# EasyEDA Pro project Isaac.epro

# Schematic Schematic1_1
Board Name: Board1_1; Create Date: 2025-03-01; Page Name: P1; Project Name: ESP-Glasses; Schematic Name: Schematic1_1; Update Date: 2025-03-04; Company: 嘉立创EDA; Page Size: A4; Version: V1.0
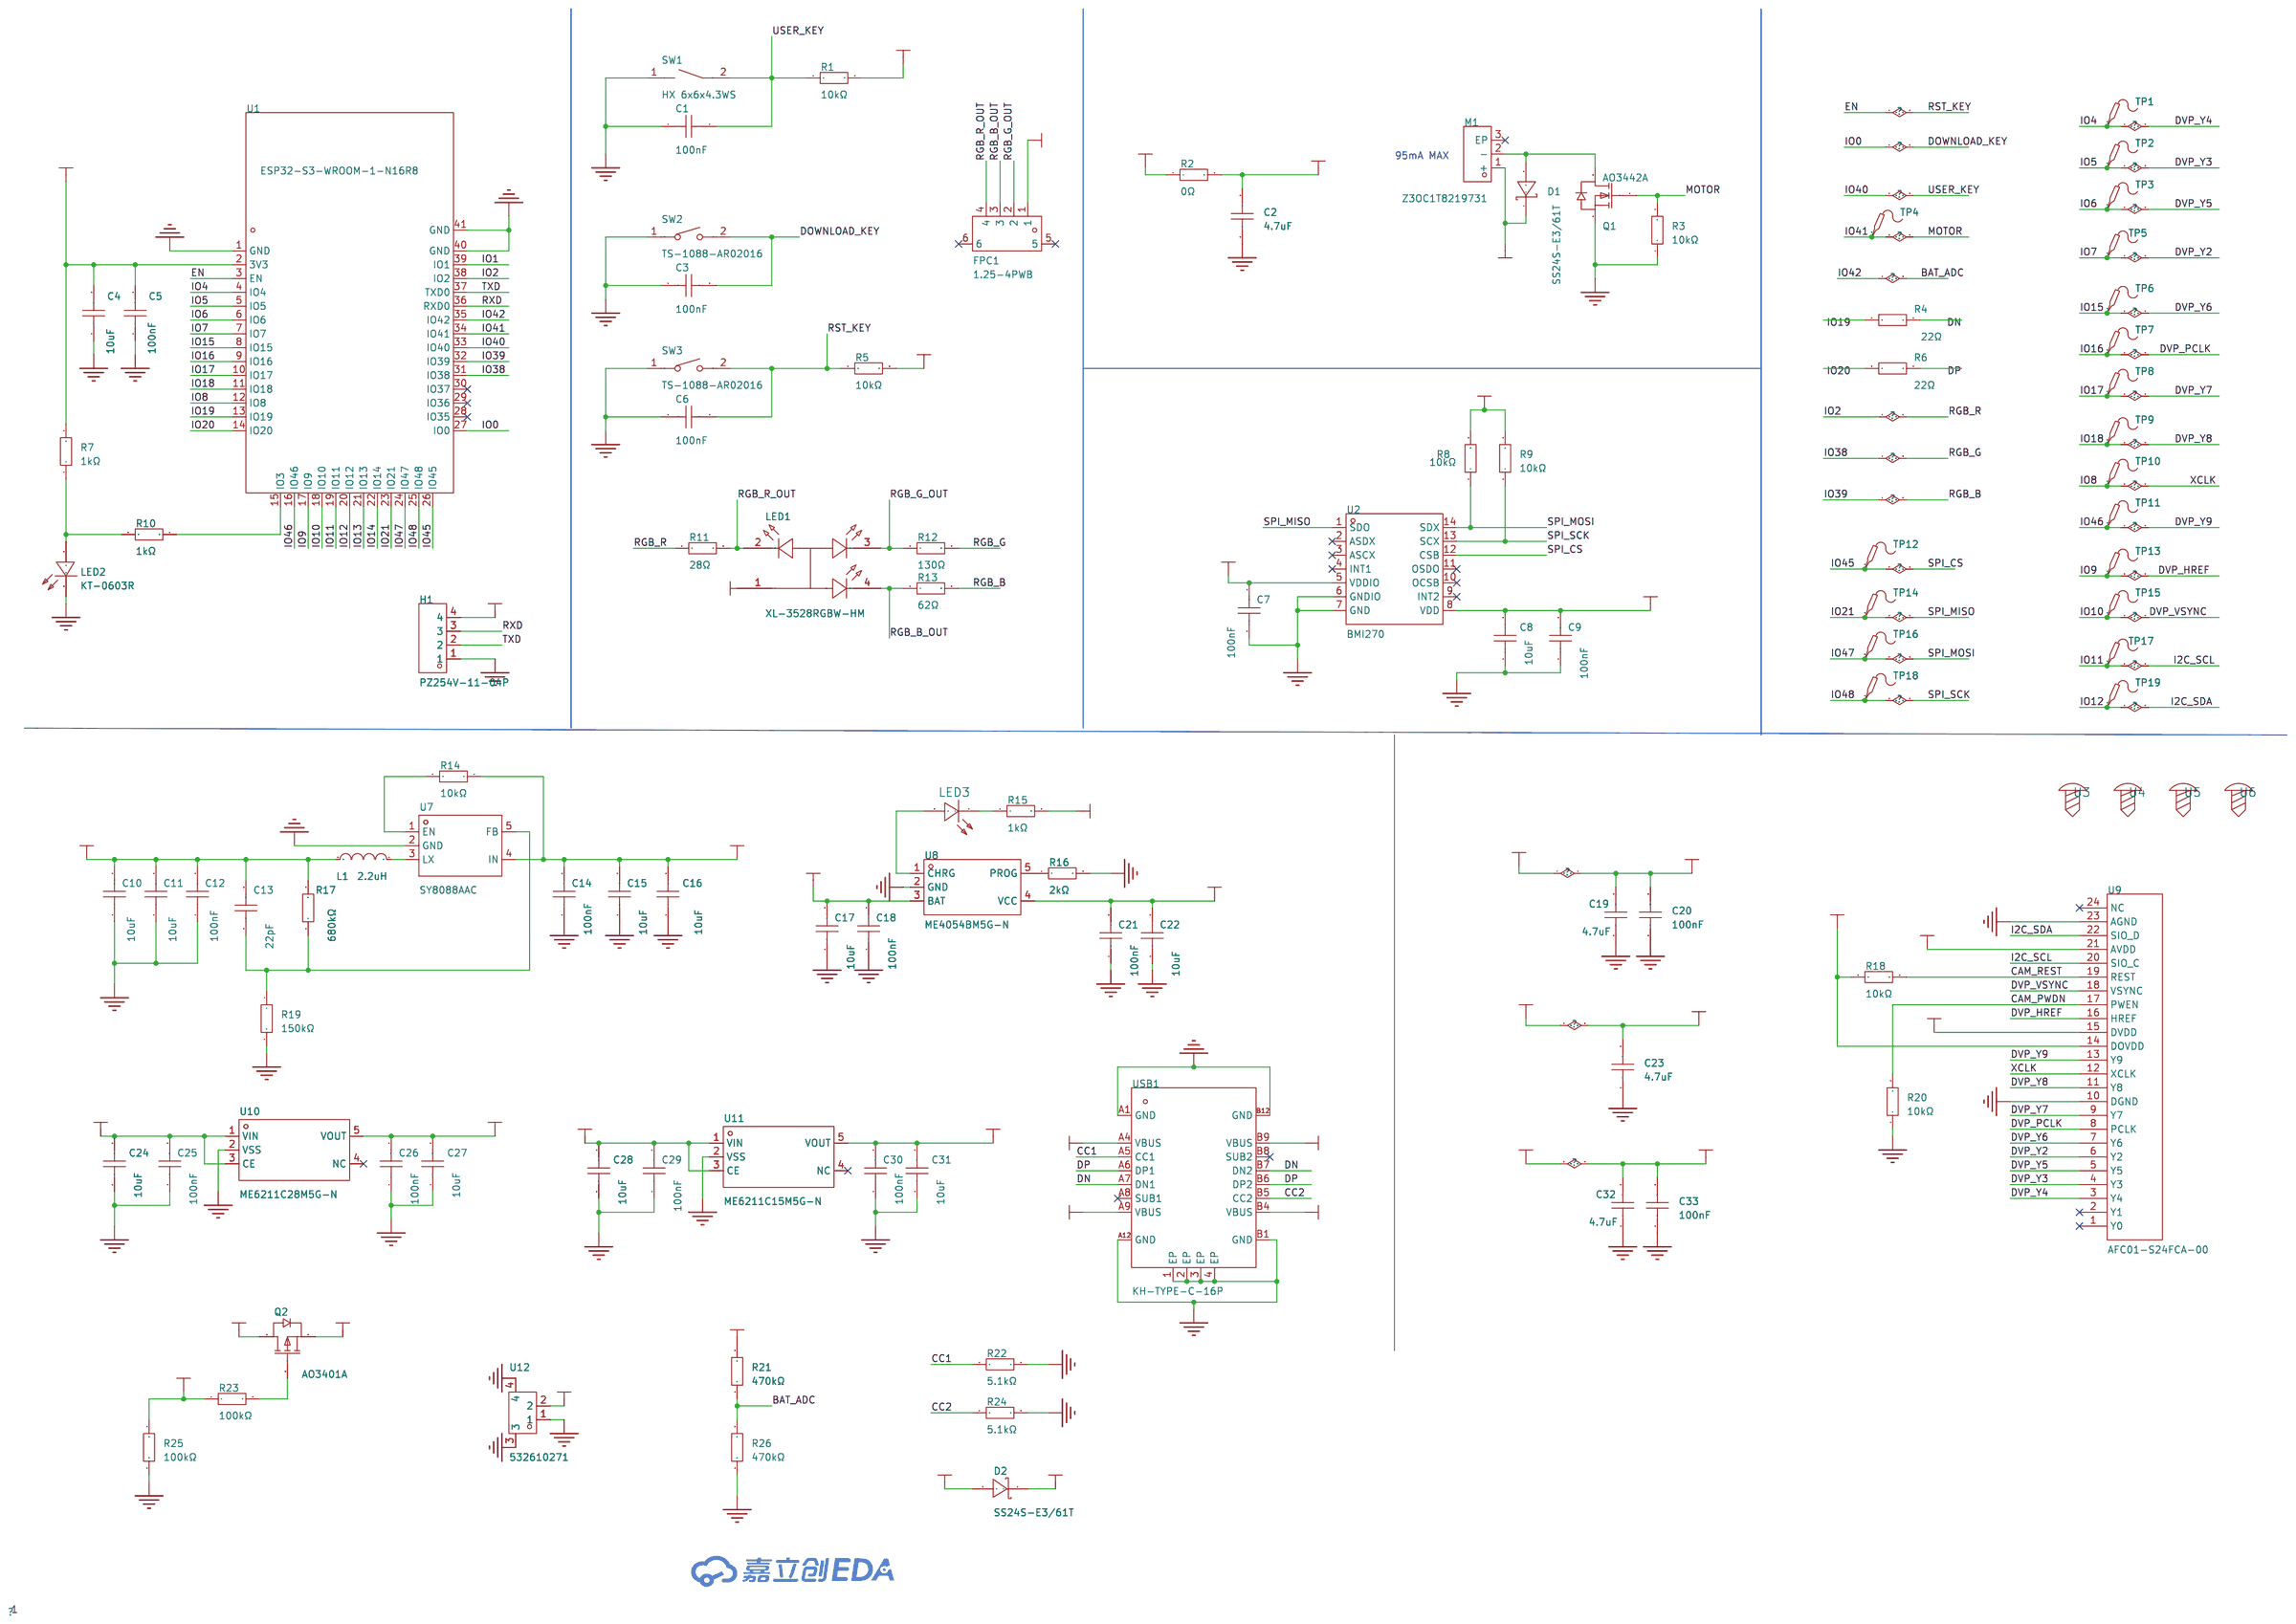
[diagram p0: schematic sheet]

## Parts
C1  100nF  [C0603]
C2  4.7uF  [C0603]
C3  100nF  [C0603]
C4  10uF  [C0603]
C5  100nF  [C0603]
C6  100nF  [C0603]
C7  100nF  [C0603]
C8  10uF  [C0603]
C9  100nF  [C0603]
C10  10uF  [C0603]
C11  10uF  [C0603]
C12  100nF  [C0603]
C13  22pF  [C0603]
C14  100nF  [C0603]
C15  10uF  [C0603]
C16  10uF  [C0603]
C17  10uF  [C0603]
C18  100nF  [C0603]
C19  4.7uF  [C0603]
C20  100nF  [C0603]
C21  100nF  [C0603]
C22  10uF  [C0603]
C23  4.7uF  [C0603]
C24  10uF  [C0603]
C25  100nF  [C0603]
C26  100nF  [C0603]
C27  10uF  [C0603]
C28  10uF  [C0603]
C29  100nF  [C0603]
C30  100nF  [C0603]
C31  10uF  [C0603]
C32  4.7uF  [C0603]
C33  100nF  [C0603]
D1  SS24S-E3/61T  [SMA_L4.4-W2.8-LS5.4-RD]
D2  SS24S-E3/61T  [SMA_L4.4-W2.8-LS5.4-RD]
FPC1  1.25-4PWB  [CONN-SMD_1.25-4PWB]
H1  PZ254V-11-04P  [HDR-TH_4P-P2.54-V-M]
L1  2.2uH  [L0603]
LED1  XL-3528RGBW-HM  [LED-SMD_4P-L3.2-W2.8-LS3.5-BL-CW]
LED2  KT-0603R  [LED0603-RD]
LED3  KT-0603R  [LED0603-RD]
M1  Z3OC1T8219731  [VIBRATING-MOTOR-SMD_3P-C9900001680]
Q1  AO3442A  [SOT-23-3_L2.9-W1.3-P1.90-LS2.4-BR]
Q2  AO3401A  [SOT-23_L2.9-W1.3-P1.90-LS2.4-BR]
R1  10kΩ  [R0603_2]
R2  0Ω  [R0603_2]
R3  10kΩ  [R0603_2]
R4  22Ω  [R0603_2]
R5  10kΩ  [R0603_2]
R6  22Ω  [R0603_2]
R7  1kΩ  [R0603_2]
R8  10kΩ  [R0603_1]
R9  10kΩ  [R0603_1]
R10  1kΩ  [R0603_2]
R11  28Ω  [R0603_2]
R12  130Ω  [R0603_2]
R13  62Ω  [R0603_2]
R14  10kΩ  [R0603_2]
R15  1kΩ  [R0603_2]
R16  2kΩ  [R0603_2]
R17  680kΩ  [R0603_2]
R18  10kΩ  [R0603_2]
R19  150kΩ  [R0603_2]
R20  10kΩ  [R0603_2]
R21  470kΩ  [R0603_2]
R22  5.1kΩ  [R0603_2]
R23  100kΩ  [R0603_2]
R24  5.1kΩ  [R0603_2]
R25  100kΩ  [R0603_2]
R26  470kΩ  [R0603_2]
SW1  HX 6x6x4.3WS  [SW-SMD_HX6X6X4.3WS]
SW2  TS-1088-AR02016  [SW-SMD_L3.9-W3.0-P4.45]
SW3  TS-1088-AR02016  [SW-SMD_L3.9-W3.0-P4.45]
TP1  -  [TESTPOINT-SMD_BD1.5_YZ212411105R-01]
TP2  -  [TESTPOINT-SMD_BD1.5_YZ212411105R-01]
TP3  -  [TESTPOINT-SMD_BD1.5_YZ212411105R-01]
TP4  -  [TESTPOINT-SMD_BD1.5_YZ212411105R-01]
TP5  -  [TESTPOINT-SMD_BD1.5_YZ212411105R-01]
TP6  -  [TESTPOINT-SMD_BD1.5_YZ212411105R-01]
TP7  -  [TESTPOINT-SMD_BD1.5_YZ212411105R-01]
TP8  -  [TESTPOINT-SMD_BD1.5_YZ212411105R-01]
TP9  -  [TESTPOINT-SMD_BD1.5_YZ212411105R-01]
TP10  -  [TESTPOINT-SMD_BD1.5_YZ212411105R-01]
TP11  -  [TESTPOINT-SMD_BD1.5_YZ212411105R-01]
TP12  -  [TESTPOINT-SMD_BD1.5_YZ212411105R-01]
TP13  -  [TESTPOINT-SMD_BD1.5_YZ212411105R-01]
TP14  -  [TESTPOINT-SMD_BD1.5_YZ212411105R-01]
TP15  -  [TESTPOINT-SMD_BD1.5_YZ212411105R-01]
TP16  -  [TESTPOINT-SMD_BD1.5_YZ212411105R-01]
TP17  -  [TESTPOINT-SMD_BD1.5_YZ212411105R-01]
TP18  -  [TESTPOINT-SMD_BD1.5_YZ212411105R-01]
TP19  -  [TESTPOINT-SMD_BD1.5_YZ212411105R-01]
U1  ESP32-S3-WROOM-1-N16R8  [WIRELM-SMD_ESP32-S3-WROOM-1]
U2  BMI270  [LGA-14_L3.0-W2.5-P0.50-BR]
U3  -  [M2.5]  (no BOM)
U4  -  [M2.5]  (no BOM)
U5  -  [M2.5]  (no BOM)
U6  -  [M2.5]  (no BOM)
U7  SY8088AAC  [SOT-23-5_L3.0-W1.7-P0.95-LS2.8-BR]
U8  ME4054BM5G-N  [TSOT-23-5_L2.9-W1.6-P0.95-LS2.8-BL]
U9  AFC01-S24FCA-00  [FPC0.5 2H-S-W-24P]
U10  ME6211C28M5G-N  [SOT-23-5_L3.0-W1.7-P0.95-LS2.8-BR]
U11  ME6211C15M5G-N  [SOT-23-5_L3.0-W1.7-P0.95-LS2.8-BR]
U12  532610271  [CONN-SMD_532610271]
USB1  KH-TYPE-C-16P  [USB-C-SMD_KH-TYPE-C-16P]

## Library data of the parts
C1 C3 C5-C7 C9 C12 C14 C18 C20 C21 C25 C26 C29 C30 C33 = CC0603KRX7R9BB104: 容值:100nF;精度:±10%;额定电压:50V;材质(温度系数):X7R;; LCSC Part Name: 100nF ±10% 50V; Supplier Part: C14663; Manufacturer: YAGEO(国巨); Supplier Footprint: 0603; JLCPCB Part Class: Basic Part; Datasheet: https://atta.szlcsc.com/upload/public/pdf/source/20180910/C282072_33301C7F631E79921B82A8DAC6BCC5B3.pdf; Supplier: LCSC; Tolerance: ±10%; Voltage Rated: 50V; Temperature Coefficient: X7R
C2 C19 C23 C32 = CL10A475KO8NNNC: 容值:4.7uF;精度:±10%;额定电压:16V;材质(温度系数):X5R;; LCSC Part Name: 4.7uF ±10% 16V; Supplier Part: C19666; Manufacturer: SAMSUNG(三星); Supplier Footprint: 0603; JLCPCB Part Class: Basic Part; Datasheet: https://atta.szlcsc.com/upload/public/pdf/source/20160218/1457707763339.pdf; Supplier: LCSC; Tolerance: ±10%; Voltage Rated: 16V; Temperature Coefficient: X5R
C4 C8 C10 C11 C15-C17 C22 C24 C27 C28 C31 = CL10A106KP8NNNC: 容值:10uF;精度:±10%;额定电压:10V;材质(温度系数):X5R;; LCSC Part Name: 10uF ±10% 10V; Supplier Part: C19702; Manufacturer: SAMSUNG(三星); Supplier Footprint: 0603; JLCPCB Part Class: Basic Part; Datasheet: https://atta.szlcsc.com/upload/public/pdf/source/20160218/1457707763339.pdf; Supplier: LCSC; Tolerance: ±10%; Voltage Rated: 10V; Temperature Coefficient: X5R
C13 = CL10C220JB8NNNC: 容值:22pF;精度:±5%;额定电压:50V;材质(温度系数):C0G;; LCSC Part Name: 22pF ±5% 50V; Supplier Part: C1653; Manufacturer: SAMSUNG(三星); Supplier Footprint: 0603; JLCPCB Part Class: Basic Part; Datasheet: https://atta.szlcsc.com/upload/public/pdf/source/20160218/1457707763339.pdf; Supplier: LCSC; Tolerance: ±5%; Voltage Rated: 50V; Temperature Coefficient: C0G
D1 D2 = SS24S-E3/61T: 正向压降(Vf):550mV@2A;直流反向耐压(Vr):40V;整流电流:2A;; LCSC Part Name: 电压:40V 电流:2A; Supplier Part: C84317; Manufacturer: VISHAY(威世); Supplier Footprint: SMA(DO-214AC); JLCPCB Part Class: 扩展库; Datasheet: https://atta.szlcsc.com/upload/public/pdf/source/20171211/C84317_15129614642811174637.pdf; Supplier: LCSC; Forward Voltage (Vf@If): 550mV@2A; Reverse Voltage (Vr): 40V; Rectified Current: 2A; Reverse Leakage Current (Ir): 200uA@40V
FPC1 = 1.25-4PWB: 插针结构:1x4P;间距:1.25mm;安装方式:卧贴;参考系列:-;总PIN数:4P;排数:1;每排PIN数:4;行距:-;额定电流:-;工作温度范围:-40℃~+85℃;; LCSC Part Name: 1x4P 间距:1.25mm 卧贴; Supplier Part: C2905011; Manufacturer: DEALON(德艺隆); Supplier Footprint: SMD,P=1.25mm,卧贴; JLCPCB Part Class: 扩展库; Datasheet: https://atta.szlcsc.com/upload/public/pdf/source/20231123/1AE0876AE9C7DCFC0D68EAC4CBA881B0.pdf; Supplier: LCSC; Pins Structure: 1x4P; Pitch: 1.25mm; Mounting Style: 卧贴; Number of Pins: 4P; Number of Rows: 1; Number of PINs Per Row: 4; Operating Temperature Range: -40℃~+85℃
H1 = PZ254V-11-04P: 插针结构:1x4P;间距:2.54mm;行距:-;圆针/方针:方针;安装类型:直插;排数:单排;总PIN位数:4P;额定电流:3A;额定电压:250V;配合针长度:6mm;塑高:2.5mm;端接针长度:3mm;触头材质:-;工作温度范围:-40℃~+105℃;颜色:黑色;; LCSC Part Name: 间距:2.54mm 1x4P 直插 方针; Supplier Part: C2691448; Manufacturer: XFCN(兴飞); Supplier Footprint: 插件,P=2.54mm; JLCPCB Part Class: 扩展库; Datasheet: https://atta.szlcsc.com/upload/public/pdf/source/20200309/C492403_F9F19131791D08044AD4F84F8E751A34.pdf; Supplier: LCSC; Pin Structure: 1x4P; Pitch: 2.54mm; Circluar Pins/Square Pins: 方针; Mounting Type: 直插; Number of Rows: 单排; Number of Pins: 4P; Current Rating (Max): 3A; Voltage Rating (Max): 250V; Length of Mating Pin: 6mm; Insulation Height: 2.5mm; Length of End Connection Pin: 3mm; Operating Temperature Range: -40℃~+105℃; Color: 黑色
L1 = CMH160808B2R2MT: 电感值:2.2uH;精度:±20%;额定电流:750mA;; LCSC Part Name: 2.2uH ±20%; Supplier Part: C394950; Manufacturer: FH(风华); Supplier Footprint: 0603; JLCPCB Part Class: Extended Part; Datasheet: https://atta.szlcsc.com/upload/public/pdf/source/20230223/142B566F7A79878A07A1E031813F1064.pdf; Supplier: LCSC; Tolerance: ±20%; Rated Current: 750mA; DC Resistance (DCR): 240mΩ; Ratings: AEC-Q200
LED1 = XL-3528RGBW-HM: 3528七彩黑面贴片LED灯珠; Supplier Part: C2843813; Manufacturer: XINGLIGHT(成兴光); Supplier Footprint: SMD3528-4P; JLCPCB Part Class: 扩展库; Datasheet: https://atta.szlcsc.com/upload/public/pdf/source/20240218/2365C2EA0FCB86676330A0FF1633A13A.pdf; Supplier: LCSC; Diode Configuration: 共阳极; Viewing Angle: 120°; Installation Method: 正贴; Operating Temperature: -20℃~+85℃
LED2 = KT-0603R: 发光颜色:红色;功率:-;正向电流:-;主波长:-;二极管配置:-;透镜颜色:-;色温:-;发光角度:-;载带方式:-;工作温度:-40℃~+85℃;; LCSC Part Name: 0603 红灯 高亮; Supplier Part: C2286; Manufacturer: KENTO; Supplier Footprint: 0603; JLCPCB Part Class: Basic Part; Datasheet: https://atta.szlcsc.com/upload/public/pdf/source/20160616/1466072038404.pdf; Supplier: LCSC; Emitted Color: 红色; Operating Temperature: -40℃~+85℃; Forward Voltage (VF): 1.6V~2.6V; Luminous Intensity: 80mcd~220mcd
LED3 = KT-0603R: 发光颜色:红色;功率:-;正向电流:-;主波长:-;二极管配置:-;透镜颜色:-;色温:-;发光角度:-;载带方式:-;工作温度:-40℃~+85℃;; LCSC Part Name: 0603 红灯 高亮; Supplier Part: C2286; Manufacturer: KENTO; Supplier Footprint: 0603; JLCPCB Part Class: Basic Part; Datasheet: https://atta.szlcsc.com/upload/public/pdf/source/20160616/1466072038404.pdf; Supplier: LCSC; Emitted Color: 红色; Operating Temperature: -40℃~+85℃
M1 = Z3OC1T8219731: 类型:圆柱直流马达;额定电压:2.7V;额定转速:14000±2500rpm;旋转方向:CW;; Supplier Part: C2894731; Manufacturer: KOTL(金龙机电); JLCPCB Part Class: 扩展库; Datasheet: https://atta.szlcsc.com/upload/public/pdf/source/20210908/21604D4C77F5141C93AFC2CF1DCB74B9.pdf; Supplier: LCSC; Type: 圆柱直流马达; Voltage Rating: 2.7V; Current Rating: 85mA; Rated Speed: 14000±2500rpm; Operating Temperature: -20℃~+70℃; Sense Of Rotation: CW
Q1 = AO3442A: 类型:1个N沟道;漏源电压(Vdss):100V;连续漏极电流(Id):1A;导通电阻(RDS(on)):720mΩ@4.5V,0.8A;耗散功率(Pd):1.4W;阈值电压(Vgs(th)):2.9V;; LCSC Part Name: 1个N沟道 耐压:100V 电流:1A; Supplier Part: C545579; Manufacturer: UMW(友台半导体); Supplier Footprint: SOT-23-3; JLCPCB Part Class: 扩展库; Datasheet: https://atta.szlcsc.com/upload/public/pdf/source/20231109/292CC397EA0B9B8801174C065CB75A7E.pdf; Supplier: LCSC; Type: 1个N沟道; Drain to Source Voltage: 100V; Current - Continuous Drain(Id): 1A; RDS(on): 720mΩ@4.5V,0.8A; Pd - Power Dissipation: 1.4W; Gate Threshold Voltage (Vgs(th)@Id): 2.9V; Gate Charge(Qg): 1.5nC@4.5V; Input Capacitance(Ciss@Vds): 100pF; Reverse Transfer Capacitance (Crss@Vds): 5pF; Operating Temperature: -55℃~+150℃
Q2 = AO3401A_C15127: 类型:1个P沟道;漏源电压(Vdss):30V;连续漏极电流(Id):4A;导通电阻(RDS(on)@Vgs,Id):44mΩ@10V,4.3A;功率(Pd):1.4W;阈值电压(Vgs(th)@Id):1.3V@250uA;; LCSC Part Name: 1个P沟道 耐压:30V 电流:4A; Supplier Part: C15127; Manufacturer: AOS; Supplier Footprint: SOT-23; JLCPCB Part Class: 基础库; Datasheet: https://atta.szlcsc.com/upload/public/pdf/source/20160507/1462613609053.pdf; Supplier: LCSC; Type: 1个P沟道; Drain Source Voltage (Vdss): 30V; Continuous Drain Current (Id): 4A; Drain Source On Resistance (RDS(on)@Vgs,Id): 44mΩ@10V,4.3A; Power Dissipation (Pd): 1.4W; Gate Threshold Voltage (Vgs(th)@Id): 1.3V@250uA; Total Gate Charge (Qg@Vgs): 12.2nC@4.5V; Input Capacitance (Ciss@Vds): 1.2nF@15V; Operating Temperature: -55℃~+150℃@(Tj)
R1 R3 R5 R14 R18 R20 = 0603WAF1002T5E: 电阻类型:厚膜电阻;阻值:10kΩ;精度:±1%;功率:100mW;最大工作电压:75V;温度系数:±100ppm/℃;; LCSC Part Name: 厚膜电阻 10kΩ ±1% 100mW; Supplier Part: C25804; Manufacturer: UNI-ROYAL(厚声); Supplier Footprint: 0603; JLCPCB Part Class: Basic Part; Datasheet: https://atta.szlcsc.com/upload/public/pdf/source/20200306/C422600_1E6D84923E4A46A82E41ADD87F860B5C.pdf; Supplier: LCSC; Type: 厚膜电阻; Tolerance: ±1%; Power(Watts): 100mW; Overload Voltage (Max): 75V; Temperature Coefficient: ±100ppm/℃; Operating Temperature Range: -55℃~+155℃
R2 = 0603WAF0000T5E: 电阻类型:厚膜电阻;阻值:0Ω;精度:±1%;功率:100mW;最大工作电压:75V;; LCSC Part Name: 0Ω ±1% 100mW 厚膜电阻; Supplier Part: C21189; Manufacturer: UNI-ROYAL(厚声); Supplier Footprint: 0603; JLCPCB Part Class: Basic Part; Datasheet: https://atta.szlcsc.com/upload/public/pdf/source/20200306/C422600_1E6D84923E4A46A82E41ADD87F860B5C.pdf; Supplier: LCSC; Type: 厚膜电阻; Tolerance: ±1%; Power(Watts): 100mW; Overload Voltage (Max): 75V; Operating Temperature Range: -55℃~+155℃
R4 R6 = 0603WAF220JT5E: 电阻类型:厚膜电阻;阻值:22Ω;精度:±1%;功率:100mW;最大工作电压:75V;温度系数:±100ppm/℃;; LCSC Part Name: 22Ω ±1% 100mW 厚膜电阻; Supplier Part: C23345; Manufacturer: UNI-ROYAL(厚声); Supplier Footprint: 0603; JLCPCB Part Class: Basic Part; Datasheet: https://atta.szlcsc.com/upload/public/pdf/source/20200306/C422600_1E6D84923E4A46A82E41ADD87F860B5C.pdf; Supplier: LCSC; Type: 厚膜电阻; Tolerance: ±1%; Power(Watts): 100mW; Overload Voltage (Max): 75V; Temperature Coefficient: ±100ppm/℃; Operating Temperature Range: -55℃~+155℃; Check: true
R7 R10 R15 = 0603WAF1001T5E: 电阻类型:厚膜电阻;阻值:1kΩ;精度:±1%;功率:100mW;最大工作电压:75V;温度系数:±100ppm/℃;; LCSC Part Name: 1kΩ ±1% 100mW 厚膜电阻; Supplier Part: C21190; Manufacturer: UNI-ROYAL(厚声); Supplier Footprint: 0603; JLCPCB Part Class: Basic Part; Datasheet: https://atta.szlcsc.com/upload/public/pdf/source/20200306/C422600_1E6D84923E4A46A82E41ADD87F860B5C.pdf; Supplier: LCSC; Type: 厚膜电阻; Tolerance: ±1%; Power(Watts): 100mW; Overload Voltage (Max): 75V; Temperature Coefficient: ±100ppm/℃; Operating Temperature Range: -55℃~+155℃; Check: true
R8 R9 = 0603WAF1002T5E: 电阻类型:厚膜电阻;阻值:10kΩ;精度:±1%;功率:100mW;最大工作电压:75V;温度系数:±100ppm/℃;; LCSC Part Name: 10kΩ ±1% 100mW 厚膜电阻; Supplier Part: C25804; Manufacturer: UNI-ROYAL(厚声); Supplier Footprint: 0603; JLCPCB Part Class: Basic Part; Datasheet: https://atta.szlcsc.com/upload/public/pdf/source/20200306/C422600_1E6D84923E4A46A82E41ADD87F860B5C.pdf; Supplier: LCSC; Type: 厚膜电阻; Tolerance: ±1%; Power(Watts): 100mW; Overload Voltage (Max): 75V; Temperature Coefficient: ±100ppm/℃; Operating Temperature Range: -55℃~+155℃
R11 = AC0603FR-0728RL: 电阻类型:厚膜电阻;阻值:28Ω;精度:±1%;功率:100mW;最大工作电压:75V;温度系数:±100ppm/℃;; LCSC Part Name: 厚膜电阻 28Ω ±1% 100mW; Supplier Part: C227760; Manufacturer: YAGEO(国巨); Supplier Footprint: 0603; JLCPCB Part Class: Extended Part; Datasheet: https://atta.szlcsc.com/upload/public/pdf/source/20181114/C227760_1107EB9580D42F183722CEBCC386176A.pdf; Supplier: LCSC; Type: 厚膜电阻; Tolerance: ±1%; Power(Watts): 100mW; Overload Voltage (Max): 75V; Temperature Coefficient: ±100ppm/℃; Operating Temperature Range: -55℃~+155℃; Check: true
R12 = 0603WAF1300T5E: 电阻类型:厚膜电阻;阻值:130Ω;精度:±1%;功率:100mW;最大工作电压:75V;温度系数:±100ppm/℃;; LCSC Part Name: 130Ω ±1% 100mW 厚膜电阻; Supplier Part: C22796; Manufacturer: UNI-ROYAL(厚声); Supplier Footprint: 0603; JLCPCB Part Class: Extended Part; Datasheet: https://atta.szlcsc.com/upload/public/pdf/source/20200306/C422600_1E6D84923E4A46A82E41ADD87F860B5C.pdf; Supplier: LCSC; Type: 厚膜电阻; Tolerance: ±1%; Power(Watts): 100mW; Overload Voltage (Max): 75V; Temperature Coefficient: ±100ppm/℃; Operating Temperature Range: -55℃~+155℃; Check: true
R13 = RC0603FR-0762RL: 电阻类型:厚膜电阻;阻值:62Ω;精度:±1%;功率:100mW;最大工作电压:75V;温度系数:±100ppm/℃;; LCSC Part Name: 厚膜电阻 62Ω ±1% 100mW; Supplier Part: C245989; Manufacturer: YAGEO(国巨); Supplier Footprint: 0603; JLCPCB Part Class: Extended Part; Datasheet: https://atta.szlcsc.com/upload/public/pdf/source/20181031/C326976_E9901E35333D136A19B6CE377E889A82.pdf; Supplier: LCSC; Type: 厚膜电阻; Tolerance: ±1%; Power(Watts): 100mW; Overload Voltage (Max): 75V; Temperature Coefficient: ±100ppm/℃; Operating Temperature Range: -55℃~+155℃
R16 = 0603WAF2001T5E: 电阻类型:厚膜电阻;阻值:2kΩ;精度:±1%;功率:100mW;最大工作电压:75V;温度系数:±100ppm/℃;; LCSC Part Name: 2kΩ ±1% 100mW 厚膜电阻; Supplier Part: C22975; Manufacturer: UNI-ROYAL(厚声); Supplier Footprint: 0603; JLCPCB Part Class: Basic Part; Datasheet: https://atta.szlcsc.com/upload/public/pdf/source/20200306/C422600_1E6D84923E4A46A82E41ADD87F860B5C.pdf; Supplier: LCSC; Type: 厚膜电阻; Tolerance: ±1%; Power(Watts): 100mW; Overload Voltage (Max): 75V; Temperature Coefficient: ±100ppm/℃; Operating Temperature Range: -55℃~+155℃; Check: true
R17 = 0603WAF6803T5E: 电阻类型:厚膜电阻;阻值:680kΩ;精度:±1%;功率:100mW;最大工作电压:75V;温度系数:±100ppm/℃;; LCSC Part Name: 680kΩ ±1% 100mW 厚膜电阻; Supplier Part: C25822; Manufacturer: UNI-ROYAL(厚声); Supplier Footprint: 0603; JLCPCB Part Class: Extended Part; Datasheet: https://atta.szlcsc.com/upload/public/pdf/source/20200306/C422600_1E6D84923E4A46A82E41ADD87F860B5C.pdf; Supplier: LCSC; Type: 厚膜电阻; Tolerance: ±1%; Power(Watts): 100mW; Overload Voltage (Max): 75V; Temperature Coefficient: ±100ppm/℃; Operating Temperature Range: -55℃~+155℃; Check: true
R19 = 0603WAF1503T5E: 电阻类型:厚膜电阻;阻值:150kΩ;精度:±1%;功率:100mW;最大工作电压:75V;温度系数:±100ppm/℃;; LCSC Part Name: 150kΩ ±1% 100mW 厚膜电阻; Supplier Part: C22807; Manufacturer: UNI-ROYAL(厚声); Supplier Footprint: 0603; JLCPCB Part Class: Basic Part; Datasheet: https://atta.szlcsc.com/upload/public/pdf/source/20200306/C422600_1E6D84923E4A46A82E41ADD87F860B5C.pdf; Supplier: LCSC; Type: 厚膜电阻; Tolerance: ±1%; Power(Watts): 100mW; Overload Voltage (Max): 75V; Temperature Coefficient: ±100ppm/℃; Operating Temperature Range: -55℃~+155℃; Check: true
R21 R26 = 0603WAF4703T5E: 电阻类型:厚膜电阻;阻值:470kΩ;精度:±1%;功率:100mW;最大工作电压:75V;温度系数:±100ppm/℃;; LCSC Part Name: 470kΩ ±1% 100mW 厚膜电阻; Supplier Part: C23178; Manufacturer: UNI-ROYAL(厚声); Supplier Footprint: 0603; JLCPCB Part Class: Basic Part; Datasheet: https://atta.szlcsc.com/upload/public/pdf/source/20200306/C422600_1E6D84923E4A46A82E41ADD87F860B5C.pdf; Supplier: LCSC; Type: 厚膜电阻; Tolerance: ±1%; Power(Watts): 100mW; Overload Voltage (Max): 75V; Temperature Coefficient: ±100ppm/℃; Operating Temperature Range: -55℃~+155℃; Check: true
R22 R24 = 0603WAF5101T5E: 电阻类型:厚膜电阻;阻值:5.1kΩ;精度:±1%;功率:100mW;最大工作电压:75V;温度系数:±100ppm/℃;; LCSC Part Name: 5.1kΩ ±1% 100mW 厚膜电阻; Supplier Part: C23186; Manufacturer: UNI-ROYAL(厚声); Supplier Footprint: 0603; JLCPCB Part Class: Basic Part; Datasheet: https://atta.szlcsc.com/upload/public/pdf/source/20200306/C422600_1E6D84923E4A46A82E41ADD87F860B5C.pdf; Supplier: LCSC; Type: 厚膜电阻; Tolerance: ±1%; Power(Watts): 100mW; Overload Voltage (Max): 75V; Temperature Coefficient: ±100ppm/℃; Operating Temperature Range: -55℃~+155℃; Check: true
R23 R25 = 0603WAF1003T5E: 电阻类型:厚膜电阻;阻值:100kΩ;精度:±1%;功率:100mW;最大工作电压:75V;温度系数:±100ppm/℃;; LCSC Part Name: 100kΩ ±1% 100mW 厚膜电阻; Supplier Part: C25803; Manufacturer: UNI-ROYAL(厚声); Supplier Footprint: 0603; JLCPCB Part Class: Basic Part; Datasheet: https://atta.szlcsc.com/upload/public/pdf/source/20200306/C422600_1E6D84923E4A46A82E41ADD87F860B5C.pdf; Supplier: LCSC; Type: 厚膜电阻; Tolerance: ±1%; Power(Watts): 100mW; Overload Voltage (Max): 75V; Temperature Coefficient: ±100ppm/℃; Operating Temperature Range: -55℃~+155℃
SW1 = HX 6x6x4.3WS: 按钮形状:圆形按钮;作用力:2.5N;安装方式:立贴;开关长度:6mm;开关宽度:6mm;开关高度:4.3mm;带支架:-;触点电流:50mA;额定电压:12V;带灯:无;机械寿命:10万次;; LCSC Part Name: 6*6*4.3mm 立贴 硅胶软开关 无声按键 TS-1068; Supplier Part: C25168849; Manufacturer: hanxia(韩下); Supplier Footprint: SMD,6x6mm; JLCPCB Part Class: 扩展库; Datasheet: https://atta.szlcsc.com/upload/public/pdf/source/20240703/3A2469BF80B030150B345F81C4051659.pdf; Supplier: LCSC; Actuator Style: 圆形按钮; Operating Force: 2.5N; Mounting Type: 立贴; Length: 6mm; Width: 6mm; Switch Height: 4.3mm; Contact Current: 50mA; Voltage Rating: 12V; With Lamp: 无; Termination Style: SMD接片; Mechanical Life: 10万次
SW2 SW3 = TS-1088-AR02016: 电路结构:单刀单掷;按钮形状:圆形按钮;作用力:160gf;安装方式:立贴;开关长度:4mm;开关宽度:3mm;开关高度:2mm;带支架:不带;触点电流:50mA;额定电压(DC):12V;绝缘电阻:100MΩ;机械寿命:10万次;; LCSC Part Name: 4*3*2mm 立贴 轻触开关; Supplier Part: C720477; Manufacturer: XUNPU(讯普); Supplier Footprint: SMD; JLCPCB Part Class: 扩展库; Datasheet: https://atta.szlcsc.com/upload/public/pdf/source/20200810/C720475_60D09DD6C54279ADDB2DC25100F1CC11.pdf; Supplier: LCSC; Circuit: 单刀单掷; Actuator Style: 圆形按钮; Operating Force: 160gf; Mounting Style: 立贴; Switch Length: 4mm; Switch Width: 3mm; Switch Height: 2mm; Strike Gundam: 不带; Contact Current: 50mA; Voltage Rating (DC): 12V; Insulation Resistance: 100MΩ; Actuator/Cap Color: 黑色; Pin Style: SMD接片; Mechanical Life: 10万次; Operating Temperature: -30℃~+80℃
TP1-TP19 = Test-Point: Test Point 测试点
U1 = ESP32-S3-WROOM-1-N16R8: LCSC Part Name: 通用型Wi-Fi+低功耗蓝牙MCU模组; Supplier Part: C2913202; Manufacturer: ESPRESSIF(乐鑫); Supplier Footprint: SMD,18x25.5mm; JLCPCB Part Class: 扩展库; Datasheet: https://atta.szlcsc.com/upload/public/pdf/source/20220705/4E799F39581577F766659887F738A439.pdf; Supplier: LCSC
U2 = BMI270: 传感器类型:加速度计陀螺仪;; Supplier Part: C2836813; Manufacturer: Bosch(博世); Supplier Footprint: LGA-14(2.5x3); JLCPCB Part Class: 扩展库; Datasheet: https://atta.szlcsc.com/upload/public/pdf/source/20210625/C2836813_35E1F3F92097F45A3828DF13DDBA01A5.pdf; Supplier: LCSC; Sensor Type: 加速度计陀螺仪; Operating Temperature: -40℃~+85℃
U3-U6 = M2.5
U7 = SY8088AAC: 功能类型:降压型;输出类型:-;工作电压:2.5V~5.5V;输出电压:-;输出电流:-;; LCSC Part Name: 1.5MHz 1A 同步降压DC/DC调节器; Supplier Part: C79313; Manufacturer: silergy(矽力杰); Supplier Footprint: SOT-23-5; JLCPCB Part Class: 扩展库; Datasheet: https://atta.szlcsc.com/upload/public/pdf/source/20170329/1490752163260.pdf; Supplier: LCSC; Function: 降压型; Input Voltage: 2.5V~5.5V; Switching Frequency: 1.5MHz; Operating Temperature: -40℃~+125℃; Synchronous Rectification: 是; Number of Outputs: 1; Topology: 降压式; Quiescent Current (Iq): 40uA
U8 = ME4054BM5G-N: Supplier Part: C478383; Manufacturer: MICRONE(南京微盟); Supplier Footprint: SOT-23-5; JLCPCB Part Class: 扩展库; Datasheet: https://atta.szlcsc.com/upload/public/pdf/source/20191226/C478383_334A5ED125CA9F8F85F7DE0AC0ECFE6D.pdf; Supplier: LCSC
U9 = AFC01-S24FCA-00: 锁定特性:翻盖式;触点类型:下接;触点数量:24P;间距:0.5mm;安装类型:卧贴;; LCSC Part Name: 间距:0.5mm P数:24P 翻盖式 下接; Supplier Part: C262669; Manufacturer: JS(钜硕电子); Supplier Footprint: SMD,P=0.5mm,卧贴; JLCPCB Part Class: 扩展库; Datasheet: https://atta.szlcsc.com/upload/public/pdf/source/20190816/C413942_2A72D1AC756EAE17EEDF756A339D4500.pdf; Supplier: LCSC; Locking Feature: 翻盖式; Contact Type: 下接; Number of Contacts: 24P; Pitch: 0.5mm; Mounting Type: 卧贴; FFC, FCB Thickness: 0.3mm; Height Above Board: 2mm
U10 = ME6211C28M5G-N: 输出类型:固定;最大输入电压:6V;输出电压:2.8V;最大输出电流:450mA;电源纹波抑制比(PSRR):70dB@(1kHz);输出极性:正极;; LCSC Part Name: 输入6V 输出2.8V 450mA; Supplier Part: C53099; Manufacturer: MICRONE(南京微盟); Supplier Footprint: SOT-23-5; JLCPCB Part Class: 扩展库; Datasheet: https://atta.szlcsc.com/upload/public/pdf/source/20171014/C53099_15079757529561038531.pdf; Supplier: LCSC; Output Type: 固定; Maximum Input Voltage: 6V; Output Voltage: 2.8V; MAX Output Current: 450mA; Power Supply Rejection Ratio (PSRR): 70dB@(1kHz); Dropout Voltage: 220mV@(200mA); Output Polarity: 正极; Number of Outputs: 1
U11 = ME6211C15M5G-N: 输出类型:固定;最大输入电压:6V;输出电压:1.5V;最大输出电流:300mA;电源纹波抑制比(PSRR):70dB@(1kHz);输出极性:正极;; LCSC Part Name: 输入6V 输出1.5V 300mA; Supplier Part: C53100; Manufacturer: MICRONE(南京微盟); Supplier Footprint: SOT-23-5; JLCPCB Part Class: 扩展库; Datasheet: https://atta.szlcsc.com/upload/public/pdf/source/20151012/1457707445394.pdf; Supplier: LCSC; Output Type: 固定; Maximum Input Voltage: 6V; Output Voltage: 1.5V; MAX Output Current: 300mA; Power Supply Rejection Ratio (PSRR): 70dB@(1kHz); Output Polarity: 正极; Number of Outputs: 1
U12 = 532610271_C177225: 插针结构:1x2P;间距:1.25mm;安装方式:卧贴;参考系列:PicoBlade(MX 1.25);总PIN数:2P;排数:1;每排PIN数:2;行距:-;额定电流:1A;触头材质:磷青铜;触头镀层:锡;工作温度范围:-40℃~+105℃;; LCSC Part Name: 1x2P 间距:1.25mm 卧贴 系列:PicoBlade(MX 1.25); Supplier Part: C177225; Manufacturer: MOLEX; Supplier Footprint: SMD,P=1.25mm; JLCPCB Part Class: 扩展库; Supplier: LCSC; Pins Structure: 1x2P; Pitch: 1.25mm; Mounting Style: 卧贴; Reference Series: PicoBlade(MX 1.25); Number of Pins: 2P; Number of Rows: 1; Number of PINs Per Row: 2; Current Rating (Max): 1A; Contact Material: 磷青铜; Contact Plating: 锡; Operating Temperature Range: -40℃~+105℃; Rated Voltage (Max): 125V; Plastic Material: 玻纤增强PA; Flame Retardant Rating: UL94V-0; Supplementary Features: 辅助焊脚; Colour: 白色; Z-Height of the Board: 3.4mm; X-Length of Bottom Edge on Board (Spacing Line): 7.65mm; Y-Width of Bottom Edge on Board: 5.2mm
USB1 = KH-TYPE-C-16P: 连接器类型:Type-C;标准:-;公母:母;端口数量:1;触点数量:16P;安装方式:卧贴;额定电流 - 电源:3A;工作温度范围:-40℃~+85℃;; LCSC Part Name: Type-C 母 卧贴; Supplier Part: C709357; Manufacturer: kinghelm(金航标); Supplier Footprint: SMD; JLCPCB Part Class: 扩展库; Datasheet: https://atta.szlcsc.com/upload/public/pdf/source/20200911/C709357_AA8DCEB38BB20E3035A7ED7AE7667837.pdf; Supplier: LCSC; Connector Type: Type-C; Gender: 母; Number of Ports: 1; Number of Contacts: 16P; Mounting Style: 卧贴; Current Rating - Power (Max): 3A; Operating Temperature Range: -40℃~+85℃

## Nets
AVDD_2V8: C23.2 C26.2 C27.2 C32.2 C33.2 R2.1 R18.1 U9.14(DOVDD) U9.21(AVDD) U10.5(VOUT)
DVDD_1V5: C19.2 C20.2 C30.2 C31.2 U9.15(DVDD) U11.5(VOUT)
GND: C1.1 C2.1 C3.1 C4.1 C5.1 C6.1 C7.1 C8.1 C9.1 C10.1 C11.1 C12.1 C14.1 C15.1 C16.1 C17.1 C18.1 C19.1 C20.1 C21.1 C22.1 C23.1 C24.1 C25.1 C26.1 C27.1 C28.1 C29.1 C30.1 C31.1 C32.1 C33.1 H1.1 LED2.1(K) Q1.2(S) R3.1 R16.2 R19.2 R20.1 R22.2 R24.2 R25.1 R26.1 SW1.1 SW2.1 SW3.1 U1.1(GND) U1.40(GND) U1.41(GND) U2.6(GNDIO) U2.7(GND) U7.2(GND) U8.2(GND) U9.10(DGND) U9.23(AGND) U10.2(VSS) U11.2(VSS) U12.1 U12.3 U12.4 USB1.1(EP) USB1.2(EP) USB1.3(EP) USB1.4(EP) USB1.A1(GND) USB1.A12(GND) USB1.B1(GND) USB1.B12(GND)
VBAT: C17.2 C18.2 Q2.3(D) R21.2 U8.3(BAT) U12.2
VBUS: D2.2(A) R23.1 R25.2 USB1.A4(VBUS) USB1.A9(VBUS) USB1.B4(VBUS) USB1.B9(VBUS)
VDD_3V3: C4.2 C5.2 C7.2 C8.2 C9.2 C10.2 C11.2 C12.2 C13.2 C24.2 C25.2 C28.2 C29.2 FPC1.1 H1.4 L1.1 LED1.1(+) R1.2 R5.2 R7.2 R8.2 R9.2 R17.2 U1.2(3V3) U2.5(VDDIO) U2.8(VDD) U10.1(VIN) U10.3(CE) U11.1(VIN) U11.3(CE)
BAT_ADC: R21.1 R26.2 U1.35(IO42)
CAM_PWDN: R20.2 U9.17(PWEN)
CAM_REST: R18.2 U9.19(REST)
CC1: R22.1 USB1.A5(CC1)
CC2: R24.1 USB1.B5(CC2)
DN: R4.1 USB1.A7(DN1) USB1.B7(DN2)
DOWNLOAD_KEY: C3.2 SW2.2 U1.27(IO0)
DP: R6.1 USB1.A6(DP1) USB1.B6(DP2)
DVP_HREF: TP13.1 U1.17(IO9) U9.16(HREF)
DVP_PCLK: TP7.1 U1.9(IO16) U9.8(PCLK)
DVP_VSYNC: TP15.1 U1.18(IO10) U9.18(VSYNC)
DVP_Y2: TP5.1 U1.7(IO7) U9.6(Y2)
DVP_Y3: TP2.1 U1.5(IO5) U9.4(Y3)
DVP_Y4: TP1.1 U1.4(IO4) U9.3(Y4)
DVP_Y5: TP3.1 U1.6(IO6) U9.5(Y5)
DVP_Y6: TP6.1 U1.8(IO15) U9.7(Y6)
DVP_Y7: TP8.1 U1.10(IO17) U9.9(Y7)
DVP_Y8: TP9.1 U1.11(IO18) U9.11(Y8)
DVP_Y9: TP11.1 U1.16(IO46) U9.13(Y9)
EN: C6.2 R5.1 SW3.2 U1.3(EN)
I2C_SCL: TP17.1 U1.19(IO11) U9.20(SIO_C)
I2C_SDA: TP19.1 U1.20(IO12) U9.22(SIO_D)
IO1: U1.39(IO1)
IO2: R11.1 U1.38(IO2)
IO8: TP10.1 U1.12(IO8) U9.12(XCLK)
IO13: U1.21(IO13)
IO14: U1.22(IO14)
IO19: R4.2 U1.13(IO19)
IO20: R6.2 U1.14(IO20)
IO21: TP14.1 U1.23(IO21) U2.1(SDO)
IO38: R12.2 U1.31(IO38)
IO39: R13.2 U1.32(IO39)
IO40: C1.2 R1.1 SW1.2 U1.33(IO40)
IO41: Q1.1(G) R3.2 TP4.1 U1.34(IO41)
IO45: TP12.1 U1.26(IO45) U2.12(CSB)
IO47: R8.1 TP16.1 U1.24(IO47) U2.14(SDX)
IO48: R9.1 TP18.1 U1.25(IO48) U2.13(SCX)
MOTOR_2V8: C2.2 D1.1(K) M1.1(+) R2.2
RGB_B_OUT: FPC1.3 LED1.4(R-) R13.1
RGB_G_OUT: FPC1.2 LED1.3(G-) R12.1
RGB_R_OUT: FPC1.4 LED1.2(B-) R11.2
RXD: H1.3 U1.36(RXD0)
TXD: H1.2 U1.37(TXD0)
VUSB: C14.2 C15.2 C16.2 C21.2 C22.2 D2.1(K) Q2.2(S) R14.1 R15.2 U7.4(IN) U8.4(VCC)
$C13_1: C13.1 R17.1 R19.1 U7.5(FB)
$D1_2: D1.2(A) M1.2(-) Q1.3(D)
$L1_2: L1.2 U7.3(LX)
$LED2_2: LED2.2(A) R7.1 R10.2
$LED3_1: LED3.1(K) R15.1
$LED3_2: LED3.2(A) U8.1(CHRG)
$Q2_1: Q2.1(G) R23.2
$R10_1: R10.1 U1.15(IO3)
$R14_2: R14.2 U7.1(EN)
$R16_1: R16.1 U8.5(PROG)

Not connected (* = marked no-connect by the designer): FPC1 5* 6*; M1 3(EP)*; U1 28(IO35)* 29(IO36)* 30(IO37)*; U2 2(ASDX)* 3(ASCX)* 4(INT1)* 9(INT2)* 10(OCSB)* 11(OSDO)*; U9 1(Y0)* 2(Y1)* 24(NC)*; U10 4(NC)*; U11 4(NC)*; USB1 A8(SUB1)* B8(SUB2)*

## Notes on the sheet
- 95mA MAX

# Board PCB1_1
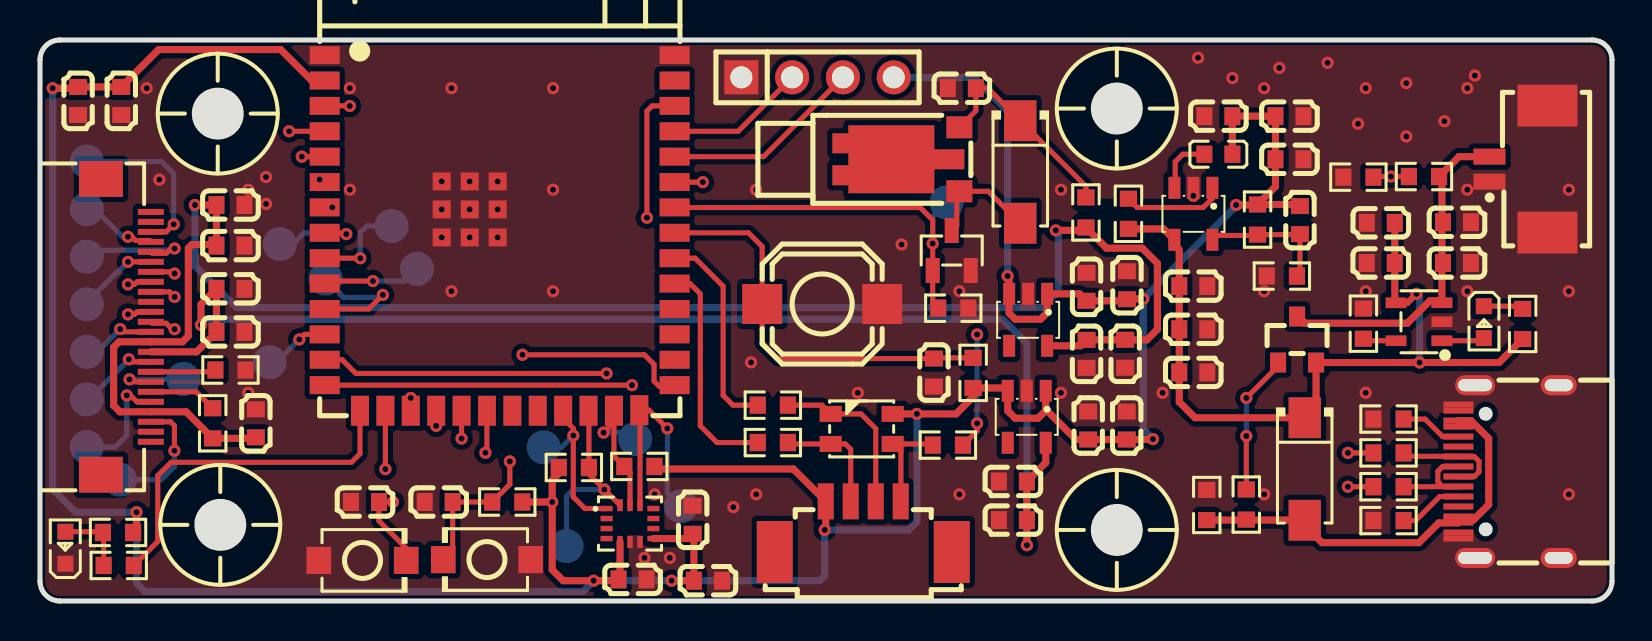
[diagram p1: board, top side]
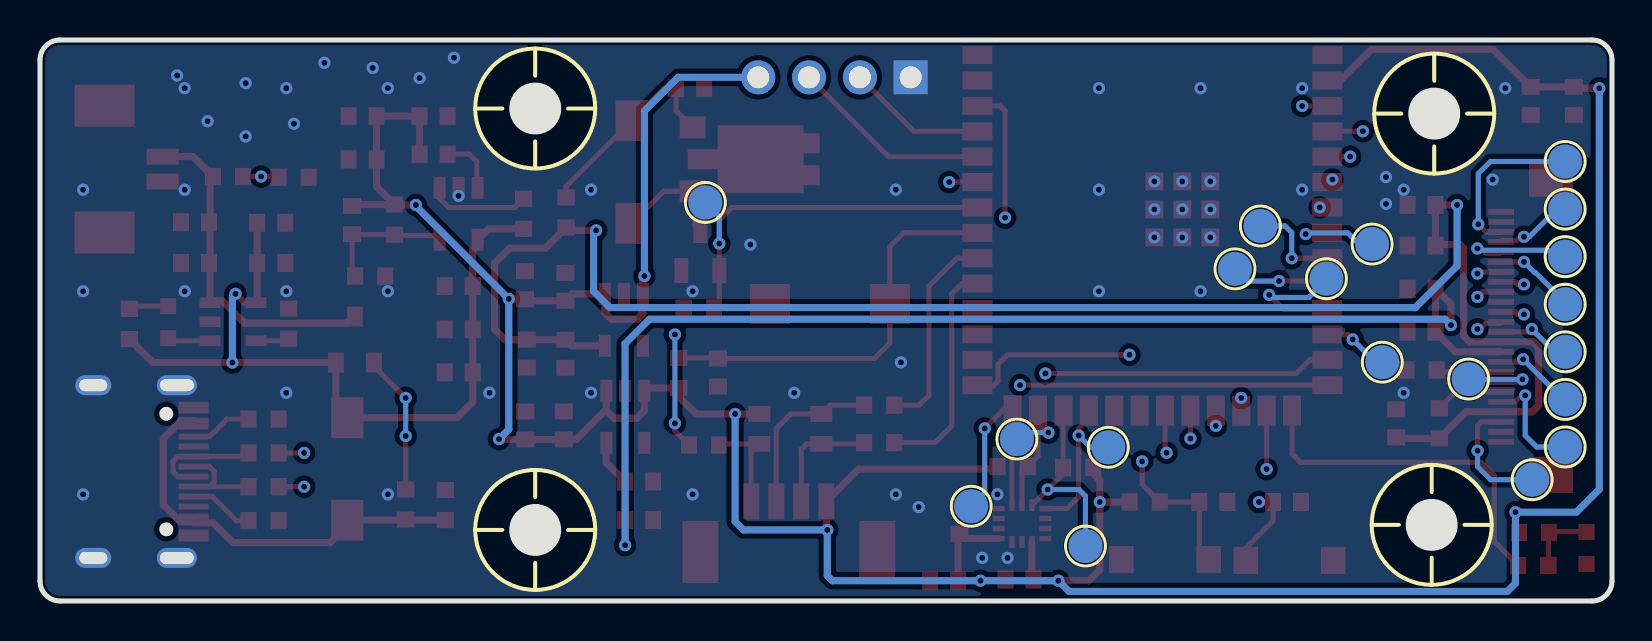
[diagram p2: board, bottom side, seen from below]

Outline 78.61 x 28.07 mm; copper layers: Top Layer, Inner1, Inner2, Bottom Layer. Coordinates in mm from the lower left corner of the outline.
Outline path: 0,27.07 0,1 arc(0.29,0.29) 1,0 77.61,0 arc(78.32,0.29) 78.61,1 78.61,27.07 arc(78.32,27.77) 77.61,28.07 1,28.07 arc(0.29,27.77) 0,27.07
Stack: Top Layer 0.035mm 外层铜厚1oz / Dielectric1 0.2104mm 7628 RC49% 8.6mil / Inner1 0.0152mm 内层铜厚 / Dielectric2 1.065mm 1.1mm H/HOZ Copper / Inner2 0.0152mm 内层铜厚 / Dielectric3 0.2104mm 7628 RC49% 8.6mil / Bottom Layer 0.035mm 外层铜厚1oz

## Design rules (mm)
net IO19: DP1
net IO20: DP1
template: 自定义配置
spacing copperThickness1oz (default): track to track 0.102, other pairs 0.152 to 0.3
spacing copperThickness2oz: track to track 0.203, other pairs 0.152 to 0.3
track width copperThickness1oz (default): min 0.127, default 0.254, max 2.54
track width copperThickness2oz: min 0.203, default 0.254, max 2.54
differential pair differentialPair (default): width min 0.127, default 0.254, max 2.54; gap min 0.152, default 0.152
via viaSize (default): diameter min 0.5, default 0.61, max 10; hole min 0.3, default 0.305, max 6.3
net GND uses copperRegion1

## Placement (name value [footprint] x y rotation side)
C1  100nF  [C0603]  44.7 11.43 90 top
C2  4.7uF  [C0603]  46.1 25.65 0 top
C3  100nF  [C0603]  16.25 4.95 0 top
C4  10uF  [C0603]  1.91 25.02 90 top
C5  100nF  [C0603]  4.06 25.02 90 top
C6  100nF  [C0603]  19.94 4.95 0 top
C7  100nF  [C0603]  29.63 1.08 180 top
C8  10uF  [C0603]  33.4 1.02 180 top
C9  100nF  [C0603]  32.64 4.06 270 top
C10  10uF  [C0603]  62.48 22.1 180 top
C11  10uF  [C0603]  62.48 24.26 180 top
C12  100nF  [C0603]  58.93 24.26 0 top
C13  22pF  [C0603]  63.01 19.06 90 top
C14  100nF  [C0603]  57.67 15.75 180 top
C15  10uF  [C0603]  57.67 13.59 180 top
C16  10uF  [C0603]  57.67 11.44 180 top
C17  10uF  [C0603]  70.86 18.95 180 top
C18  100nF  [C0603]  70.86 16.91 180 top
C19  4.7uF  [C0603]  9.52 15.62 180 top
C20  100nF  [C0603]  9.52 13.46 180 top
C21  100nF  [C0603]  67.05 16.91 0 top
C22  10uF  [C0603]  67.05 18.92 0 top
C23  4.7uF  [C0603]  10.8 8.89 270 top
C24  10uF  [C0603]  54.36 15.8 270 top
C25  100nF  [C0603]  52.34 15.72 270 top
C26  100nF  [C0603]  52.34 12.37 90 top
C27  10uF  [C0603]  54.27 12.37 90 top
C28  10uF  [C0603]  54.35 8.78 270 top
C29  100nF  [C0603]  52.42 8.78 270 top
C30  100nF  [C0603]  48.65 5.98 0 top
C31  10uF  [C0603]  48.65 4.05 0 top
C32  4.7uF  [C0603]  9.52 17.78 180 top
C33  100nF  [C0603]  9.52 19.81 180 top
D1  SS24S-E3/61T  [SMA_L4.4-W2.8-LS5.4-RD]  49.02 21.46 270 top
D2  SS24S-E3/61T  [SMA_L4.4-W2.8-LS5.4-RD]  63.25 6.6 270 top
FPC1  1.25-4PWB  [CONN-SMD_1.25-4PWB]  41.17 3.72 0 top
H1  PZ254V-11-04P  [HDR-TH_4P-P2.54-V-M]  38.88 26.2 0 top
L1  2.2uH  [L0603]  58.93 22.35 180 top
LED1  XL-3528RGBW-HM  [LED-SMD_4P-L3.2-W2.8-LS3.5-BL-CW]  41.09 8.61 180 top
LED2  KT-0603R  [LED0603-RD]  1.27 2.67 90 top
LED3  KT-0603R  [LED0603-RD]  72.2 13.95 270 top
M1  Z3OC1T8219731  [VIBRATING-MOTOR-SMD_3P-C9900001680]  44.45 22.1 0 top
Q1  AO3442A  [SOT-23-3_L2.9-W1.3-P1.90-LS2.4-BR]  45.59 17.53 270 top
Q2  AO3401A  [SOT-23_L2.9-W1.3-P1.90-LS2.4-BR]  62.87 13.08 270 top
R1  10kΩ  [R0603_2]  46.66 11.41 270 top
R2  0Ω  [R0603_2]  52.3 19.44 90 top
R3  10kΩ  [R0603_2]  45.67 14.65 180 top
R4  22Ω  [R0603_2]  67.44 5.72 180 top
R5  10kΩ  [R0603_2]  23.37 4.95 0 top
R6  22Ω  [R0603_2]  67.44 7.41 180 top
R7  1kΩ  [R0603_2]  3.9 3.43 0 top
R8  10kΩ  [R0603_1]  26.7 6.68 180 top
R9  10kΩ  [R0603_1]  29.97 6.73 0 top
R10  1kΩ  [R0603_2]  3.94 1.78 180 top
R11  28Ω  [R0603_2]  45.4 7.8 180 top
R12  130Ω  [R0603_2]  36.65 7.93 180 top
R13  62Ω  [R0603_2]  36.65 9.8 180 top
R14  10kΩ  [R0603_2]  54.43 19.37 90 top
R15  1kΩ  [R0603_2]  74.14 13.86 270 top
R16  2kΩ  [R0603_2]  66.18 13.88 90 top
R17  680kΩ  [R0603_2]  60.89 19.08 90 top
R18  10kΩ  [R0603_2]  8.64 8.89 90 top
R19  150kΩ  [R0603_2]  62.1 16.26 180 top
R20  10kΩ  [R0603_2]  9.52 11.56 180 top
R21  470kΩ  [R0603_2]  69.21 21.23 0 top
R22  5.1kΩ  [R0603_2]  67.44 4.02 180 top
R23  100kΩ  [R0603_2]  60.32 4.83 90 top
R24  5.1kΩ  [R0603_2]  67.44 9.1 180 top
R25  100kΩ  [R0603_2]  58.35 4.8 270 top
R26  470kΩ  [R0603_2]  65.93 21.2 0 top
SW1  HX 6x6x4.3WS  [SW-SMD_HX6X6X4.3WS]  39.12 14.86 180 top
SW2  TS-1088-AR02016  [SW-SMD_L3.9-W3.0-P4.45]  16.13 2.03 0 top
SW3  TS-1088-AR02016  [SW-SMD_L3.9-W3.0-P4.45]  22.35 2.07 180 top
TP1  -  [TESTPOINT-SMD_BD1.5_YZ212411105R-01]  2.34 21.99 180 bottom
TP2  -  [TESTPOINT-SMD_BD1.5_YZ212411105R-01]  2.34 19.61 180 bottom
TP3  -  [TESTPOINT-SMD_BD1.5_YZ212411105R-01]  2.34 17.23 180 bottom
TP4  -  [TESTPOINT-SMD_BD1.5_YZ212411105R-01]  45.34 19.94 180 bottom
TP5  -  [TESTPOINT-SMD_BD1.5_YZ212411105R-01]  2.34 14.85 180 bottom
TP6  -  [TESTPOINT-SMD_BD1.5_YZ212411105R-01]  12 17.86 180 bottom
TP7  -  [TESTPOINT-SMD_BD1.5_YZ212411105R-01]  17.58 18.76 180 bottom
TP8  -  [TESTPOINT-SMD_BD1.5_YZ212411105R-01]  18.85 16.62 180 bottom
TP9  -  [TESTPOINT-SMD_BD1.5_YZ212411105R-01]  14.28 16.12 180 bottom
TP10  -  [TESTPOINT-SMD_BD1.5_YZ212411105R-01]  11.49 11.95 180 bottom
TP11  -  [TESTPOINT-SMD_BD1.5_YZ212411105R-01]  2.34 12.47 180 bottom
TP12  -  [TESTPOINT-SMD_BD1.5_YZ212411105R-01]  32.05 4.74 180 bottom
TP13  -  [TESTPOINT-SMD_BD1.5_YZ212411105R-01]  2.34 10.09 180 bottom
TP14  -  [TESTPOINT-SMD_BD1.5_YZ212411105R-01]  25.19 7.69 180 bottom
TP15  -  [TESTPOINT-SMD_BD1.5_YZ212411105R-01]  7.17 11.1 180 bottom
TP16  -  [TESTPOINT-SMD_BD1.5_YZ212411105R-01]  26.33 2.75 180 bottom
TP17  -  [TESTPOINT-SMD_BD1.5_YZ212411105R-01]  2.34 7.71 180 bottom
TP18  -  [TESTPOINT-SMD_BD1.5_YZ212411105R-01]  29.76 8.1 180 bottom
TP19  -  [TESTPOINT-SMD_BD1.5_YZ212411105R-01]  3.99 6.07 180 bottom
U1  ESP32-S3-WROOM-1-N16R8  [WIRELM-SMD_ESP32-S3-WROOM-1]  22.99 18.41 0 top
U2  BMI270  [LGA-14_L3.0-W2.5-P0.50-BR]  29.51 3.88 180 top
U3  -  [M2.5]  53.85 24.64 0 top
U4  -  [M2.5]  9.02 3.81 0 top
U5  -  [M2.5]  53.85 3.56 0 top
U6  -  [M2.5]  8.89 24.38 0 top
U7  SY8088AAC  [SOT-23-5_L3.0-W1.7-P0.95-LS2.8-BR]  57.68 19.37 90 top
U8  ME4054BM5G-N  [TSOT-23-5_L2.9-W1.6-P0.95-LS2.8-BL]  68.96 13.97 90 top
U9  AFC01-S24FCA-00  [FPC0.5 2H-S-W-24P]  3.05 13.72 270 top
U10  ME6211C28M5G-N  [SOT-23-5_L3.0-W1.7-P0.95-LS2.8-BR]  49.41 14.07 90 top
U11  ME6211C15M5G-N  [SOT-23-5_L3.0-W1.7-P0.95-LS2.8-BR]  49.34 9.22 90 top
U12  532610271  [CONN-SMD_532610271]  73.94 21.61 270 top
USB1  KH-TYPE-C-16P  [USB-C-SMD_KH-TYPE-C-16P]  73.53 6.48 90 top

## Footprints (pads in the part's own frame, mm; a bottom-side part is the same pattern mirrored in y, then rotated)
C0603
  rect 0.8x0.9 smd: 1(-0.7,0) 2(0.7,0)
CONN-SMD_1.25-4PWB
  rect 0.8x1.8 smd: 1(-1.875,1.266) 2(-0.625,1.266) 3(0.625,1.266) 4(1.875,1.266)
  rect 1.8x3.1 smd: 5(-4.425,-1.266) 6(4.425,-1.266)
CONN-SMD_532610271
  rect 0.8x1.6 smd: 1(0.625,-1.45) 2(-0.625,-1.45)
  rect 2.1x3 smd: 3(3.175,1.45) 4(-3.175,1.45)
FPC0.5 2H-S-W-24P
  rect 1.8x2.2 smd: 0(-7.4,0) 0(7.4,0)
  rect 0.3x1.3 smd: 1(-5.75,2.497) 2(-5.25,2.497) 3(-4.75,2.497) 4(-4.25,2.497) 5(-3.75,2.497) 6(-3.25,2.497) 7(-2.75,2.497) 8(-2.25,2.497) 9(-1.75,2.497) 10(-1.25,2.497) 11(-0.75,2.497) 12(-0.25,2.497) 13(0.25,2.497) 14(0.75,2.497) 15(1.25,2.497) 16(1.75,2.497) 17(2.25,2.497) 18(2.75,2.497) 19(3.25,2.497) 20(3.75,2.497) 21(4.25,2.497) 22(4.75,2.497) 23(5.25,2.497) 24(5.75,2.497)
HDR-TH_4P-P2.54-V-M
  rect 1.7x1.7 hole 1.1: 1(-3.81,0)
  round 1.7 hole 1.1: 2(-1.27,0) 3(1.27,0) 4(3.81,0)
L0603
  rect 0.8x0.864 smd: 1(-0.7,0) 2(0.7,0)
LED0603-RD
  rect 0.8x0.8 smd: 1(-0.799,0) 2(0.799,0)
LED-SMD_4P-L3.2-W2.8-LS3.5-BL-CW
  rect 1.1x0.8 smd: 1(-1.55,-0.75) 2(-1.55,0.75) 3(1.55,0.75) 4(1.55,-0.75)
LGA-14_L3.0-W2.5-P0.50-BR
  rect 0.6x0.27 smd: 1(1.17,-0.75) 2(1.17,-0.25) 3(1.17,0.25) 4(1.17,0.75) 8(-1.17,0.75) 9(-1.17,0.25) 10(-1.17,-0.25) 11(-1.17,-0.75)
  rect 0.27x0.6 smd: 5(0.5,0.92) 6(0,0.92) 7(-0.5,0.92) 12(-0.5,-0.92) 13(0,-0.92) 14(0.5,-0.92)
R0603_1
  rect 0.806x0.864 smd: 1(-0.753,0) 2(0.753,0)
R0603_2
  rect 0.806x0.864 smd: 1(-0.753,0) 2(0.753,0)
SMA_L4.4-W2.8-LS5.4-RD
  rect 2.046x1.62 smd: 1(-2.566,0) 2(2.566,0)
SOT-23-3_L2.9-W1.3-P1.90-LS2.4-BR
  rect 1.25x0.7 smd: 1(1,-0.95) 2(1,0.95) 3(-1,0)
SOT-23-5_L3.0-W1.7-P0.95-LS2.8-BR
  rect 1.1x0.6 smd: 1(1.3,-0.95) 2(1.3,0) 3(1.3,0.95) 4(-1.3,0.95) 5(-1.3,-0.95)
SOT-23_L2.9-W1.3-P1.90-LS2.4-BR
  rect 1x0.8 smd: 1(1.15,-0.95) 2(1.15,0.95) 3(-1.15,0)
SW-SMD_HX6X6X4.3WS
  rect 2x2 smd: 1(-3.001,0) 2(3.001,0)
SW-SMD_L3.9-W3.0-P4.45
  rect 1.23x1.36 smd: 1(-2.185,0) 2(2.185,0)
TESTPOINT-SMD_BD1.5_YZ212411105R-01
  round 1.7 smd: 1(0,0)
TSOT-23-5_L2.9-W1.6-P0.95-LS2.8-BL
  rect 0.532x1.045 smd: 1(-0.95,-1.147) 2(0,-1.147) 3(0.95,-1.147) 4(0.95,1.147) 5(-0.95,1.147)
USB-C-SMD_KH-TYPE-C-16P
  oval 1x2 hole 0.6x1.7: 1(-4.32,1.765) 2(4.32,1.765)
  oval 1x1.8 hole 0.6x1.4: 3(-4.32,-2.415) 4(4.32,-2.415)
  rect 0.3x1.5 smd: A1(-3.35,2.6) A4(-2.55,2.6) A5(-1.25,2.6) A6(-0.25,2.6) A7(0.25,2.6) A8(1.25,2.6) A9(2.55,2.6) A12(3.35,2.6) B1(3.05,2.6) B4(2.25,2.6) B5(1.75,2.6) B6(0.75,2.6) B7(-0.75,2.6) B8(-1.75,2.6) B9(-2.25,2.6) B12(-3.05,2.6)
VIBRATING-MOTOR-SMD_3P-C9900001680
  rect 1.3x1.1 smd: 1(1.525,1.6) 2(1.525,-1.6)
  custom 6.6x3.4 smd: 3(-1.525,0)
WIRELM-SMD_ESP32-S3-WROOM-1
  rect 1.5x0.9 smd: 1(-8.75,8.895) 2(-8.75,7.625) 3(-8.75,6.355) 4(-8.75,5.085) 5(-8.75,3.815) 6(-8.75,2.545) 7(-8.75,1.275) 8(-8.75,0.005) 9(-8.75,-1.265) 10(-8.75,-2.535) 11(-8.75,-3.805) 12(-8.75,-5.075) 13(-8.75,-6.345) 14(-8.75,-7.615) 27(8.75,-7.615) 28(8.75,-6.345) 29(8.75,-5.075) 30(8.75,-3.805) 31(8.75,-2.535) 32(8.75,-1.265) 33(8.75,0.005) 34(8.75,1.275) 35(8.75,2.545) 36(8.75,3.815) 37(8.75,5.085) 38(8.75,6.355) 39(8.75,7.625) 40(8.75,8.895)
  rect 0.9x1.5 smd: 15(-6.985,-8.895) 16(-5.715,-8.895) 17(-4.445,-8.895) 18(-3.175,-8.895) 19(-1.905,-8.895) 20(-0.635,-8.895) 21(0.635,-8.895) 22(1.905,-8.895) 23(3.175,-8.895) 24(4.445,-8.895) 25(5.715,-8.895) 26(6.985,-8.865)
  rect 0.9x0.9 smd: 41(-2.9,2.575) 41(-2.9,1.175) 41(-2.9,-0.225) 41(-1.5,2.575) 41(-1.5,1.175) 41(-1.5,-0.225) 41(-0.1,2.575) 41(-0.1,1.175) 41(-0.1,-0.225)

## Nets
As in the schematic.

Pads without a net: FPC1 5 6; M1 3; U1 28 29 30; U2 2 3 4 9 10 11; U9 0 1 2 24; U10 4; U11 4; USB1 A8 B8

## Via types
v1: diameter 0.61, hole 0.305, Top Layer to Bottom Layer, 123 vias

## Routing (per net, layer and track width the routed paths; a pad name or vN(x,y) marks a point on that pad's centre or on a via; arc(x,y) is an arc through that point)
AVDD_2V8: length 89.3
  Top Layer w0.355: v1(7.75,19.81) C33.2 C32.2 8.77,17.83 7.6,17.83 7.42,17.65 7.42,13.26 7.12,12.97 U9.14 3.95,12.97 3.68,12.7 3.68,9.78 4,9.47 U9.21 7.31,9.47 R18.1 10.74,8.14 C23.2 ; U10.5 52.04,12.77 C26.2 52.34,13.07 C27.2 55.36,13.07 55.88,13.59 55.88,16.89 55.12,17.65 53.34,17.65 R2.1 52.16,18.54 v1(50.8,18.54)
  Bottom Layer w0.355: v1(7.75,19.81) 7.75,16.76 9.83,14.68 50.11,14.68 50.93,15.49 50.93,18.41 v1(50.8,18.54)
DVDD_1V5: length 65.5
  Top Layer w0.355: U9.15 7.83,12.47 C20.2 C19.2 8.05,14.85 v1(8.05,13.8) ; v1(49.35,2.79) C31.2 C30.2 50.29,6.92 U11.5
  Bottom Layer w0.355: v1(8.05,13.8) 8.35,14.1 48.13,14.1 49.35,12.88 v1(49.35,2.79)
GND:
  vias: v1(5.34,25.66) v1(5.97,21.08) v1(10.42,20.58) v1(10.42,10.42) v1(11.3,21.21) v1(11.3,19.87) v1(15.5,25.66) v1(15.5,20.58) v1(20.09,20.99) v1(20.09,19.59) v1(20.09,18.19) v1(20.58,25.66) v1(20.58,15.5) v1(21.49,20.99) v1(21.49,19.59) v1(21.49,18.19) v1(22.89,20.99) v1(22.89,19.59) v1(22.89,18.19) v1(25.66,25.66) v1(25.66,20.58) v1(25.66,15.5) v1(30.23,2.16) v1(30.74,5.34) v1(31.5,2.16) v1(34.67,4.7) v1(35.56,11.94) v1(35.82,20.58) v1(35.82,5.34) v1(40.9,10.42) v1(43.09,17.83) v1(45.98,15.5) v1(45.98,5.34) v1(51.06,20.58) v1(51.06,10.42) v1(56.14,10.42) v1(57.68,20.27) v1(57.91,27.18) v1(59.63,26.16) v1(61.22,25.66) v1(61.22,15.5) v1(61.22,5.34) v1(61.98,26.67) v1(64.39,26.92) v1(65.91,23.88) v1(66.3,25.66) v1(66.3,15.5) v1(66.3,10.42) v1(68.33,25.91) v1(68.33,23.24) v1(70.23,24) v1(71.38,25.66) v1(71.38,20.58) v1(71.38,15.5) v1(71.75,26.29) v1(76.46,20.58) v1(76.46,15.5) v1(76.46,5.34)
VBAT: length 17.2
  Top Layer w0.355: U12.2 70.96,22.23 R21.2 70.11,21.09 U8.3 70.01,15.02 69.5,15.02 68.38,13.9 63.28,13.9 62.94,14.23 Q2.3
VBUS: length 20.7
  Top Layer w0.355: R25.2 63.23,4.05 D2.2 63.25,3.78 64.11,2.92 68.96,2.92 69.95,3.91 70.91,3.91 71.06,4.05 71.68,4.05 72.02,4.39 72.02,4.39 72.44,4.82 72.44,8.14 71.56,9.02 70.93,9.02 USB1.A9
VDD_3V3: length 187.6
  Top Layer w0.355: v1(39.24,3.56) 39.29,3.61 FPC1.1 37.68,6.6 30.98,6.6 30.85,6.73 ; U2.5 29.01,1.16 C7.2 28.87,1.02 v1(27.69,1.02) 26.16,1.02 25.61,1.56 v1(25.61,4.95) ; v1(25.61,4.95) 25.61,6.05 26.07,6.5 26.07,6.68 ; v1(25.61,4.95) R5.2 ; v1(31.58,1.02) C8.2 32.7,3.3 C9.2 32.4,3.13 U2.8 ; R17.2 61.78,20.73 C10.2 C11.2 C12.2 L1.1 ; R17.2 60.86,19.81 v1(59.82,19.81) ; R17.2 62.93,19.84 C13.2 ; v1(55.17,15.11) 54.37,15.11 C24.2 54.28,15.02 52.34,15.02 51.99,15.37 U10.1 50.36,14.42 50.04,14.1 48.77,14.1 48.46,14.4 U10.3 48.46,16.18 v1(48.39,16.26) ; v1(4.83,4.44) 4.83,3.6 R7.2 ; LED1.1 v1(43.85,9.36) 45.81,9.36 46.66,10.21 R1.2 48.25,10.66 U11.3 48.39,9.52 48.77,9.14 49.91,9.14 50.29,9.53 50.29,9.59 ; U1.2 13.58,26.04 12.03,27.59 5.93,27.59 C5.2 C4.2 1.84,25.65 v1(0.63,25.65) ; 50.29,9.59 51.8,8.08 C29.2 C28.2 55.64,8.08 v1(55.66,8.1) ; 50.29,9.59 U11.1
  Bottom Layer w0.355: v1(55.66,8.1) 55.17,8.59 v1(55.17,15.11) 59.82,19.76 v1(59.82,19.81) ; v1(0.63,25.65) 0.63,5.59 1.78,4.44 v1(4.83,4.44) 4.83,0.89 5.24,0.48 27.15,0.48 v1(27.69,1.02) v1(31.58,1.02) 38.99,1.02 39.24,1.27 v1(39.24,3.56) 43.43,3.56 43.85,3.97 v1(43.85,9.36) ; v1(48.39,16.26) 48.39,24.51 46.7,26.2 H1.4
$C13_1: length 6.7
  Top Layer w0.254: R19.1 63.01,16.41 C13.1 62.98,18.33 60.89,18.33 60.85,18.29 58.85,18.29 U7.5
$D1_2: length 5.8
  Top Layer w0.254: D1.2 47.42,20.5 M1.2 45.85,20.37 45.85,18.79 Q1.3
$L1_2: length 2.9
  Top Layer w0.254: L1.2 57.15,22.35 56.77,21.97 56.77,20.71 U7.3
$LED2_2: length 3.6
  Top Layer w0.254: LED2.2 3.11,3.47 R7.1 3.18,3.39 R10.2
$LED3_1: length 2
  Top Layer w0.254: R15.1 74.01,14.75 72.2,14.75
$LED3_2: length 2.1
  Top Layer w0.254: U8.1 72.07,13.02 LED3.2
$Q2_1: length 7
  Top Layer w0.254: R23.2 v1(60.32,8.25) ; Q2.1 61.91,11.75 v1(60.32,10.16)
  Bottom Layer w0.254: v1(60.32,8.25) v1(60.32,10.16)
$R10_1: length 17.7
  Top Layer w0.254: R10.1 5.89,2.98 5.89,6.27 6.56,6.94 15.57,6.94 16,7.37 U1.15
$R14_2: length 5.1
  Top Layer w0.254: R14.2 54.87,19.69 58.17,19.69 58.63,20.15 U7.1
$R16_1: length 1.7
  Top Layer w0.254: R16.1 66.28,13.02 U8.5
BAT_ADC: length 37.7
  Top Layer w0.254: U1.35 31.74,20.95 v1(33.15,20.95) ; R21.1 v1(67.56,21.23) 66.71,21.23 R26.2
  Inner1 w0.254: v1(33.15,20.95) 33.43,21.23 v1(67.56,21.23)
CAM_PWDN: length 3.3
  Top Layer w0.254: U9.17 8.68,11.47 R20.2
CAM_REST: length 3.4
  Top Layer w0.254: U9.19 7.81,10.47 R18.2
CC1: length 3.2
  Top Layer w0.254: R22.1 68.79,4.02 70,5.23 USB1.A5
CC2: length 3.1
  Top Layer w0.254: R24.1 69.26,9.1 70.14,8.23 USB1.B5
DN: length 5.5
  Top Layer w0.254: R4.1 70.92,5.72 USB1.B7 70.14,5.73 69.9,5.96 69.9,6.49 70.14,6.73 70.93,6.73 USB1.A7
DOWNLOAD_KEY: length 26.5
  Top Layer w0.254: v1(24.13,12.32) 30.23,12.32 30.71,11.84 30.71,11 30.96,10.74 31.68,10.74 U1.27 ; SW2.2 18.31,2.64 16.95,4 C3.2 v1(17.65,4.95)
  Inner1 w0.254: v1(17.65,4.95) 23.62,4.95 24.13,5.46 v1(24.13,12.32)
DP: length 5.6
  Top Layer w0.254: USB1.A6 70.94,6.22 71.72,6.22 71.96,6.46 71.96,6.99 71.73,7.23 USB1.B6 70.92,7.24 68.36,7.24 R6.1
DVP_HREF: length 19.8
  Top Layer w0.254: v1(4.44,12.09) 4.57,11.97 U9.16
  Inner1 w0.254: v1(4.44,12.09) 18.26,12.09 18.54,11.81 v1(18.54,10.16)
  Bottom Layer w0.254: 2.6,10.07 2.6,10.25 v1(4.44,12.09)
DVP_PCLK: length 18.7
  Top Layer w0.254: v1(4.4,15.84) 4.72,15.84 4.85,15.97 U9.8 ; U1.9 v1(16.02,17.15)
  Inner1 w0.254: v1(4.4,15.84) 4.44,15.8 15.54,15.8 16.02,16.27 v1(16.02,17.15)
  Bottom Layer w0.254: v1(16.02,17.15) 16.02,18.43 16.35,18.76 TP7.1
DVP_VSYNC: length 21.7
  Top Layer w0.254: v1(4.48,11.09) 4.6,10.97 U9.18 ; v1(19.81,8.76) U1.18
  Inner1 w0.254: v1(19.81,8.76) 5.33,8.76 4.95,9.14 4.95,10.61 v1(4.48,11.09)
  Bottom Layer w0.254: TP15.1 7.15,11.09 v1(4.48,11.09)
DVP_Y2: length 16.8
  Top Layer w0.254: U9.6 v1(4.4,16.97)
  Inner1 w0.254: v1(14.62,19.69) 14.62,17.41 14.17,16.97 v1(4.4,16.97)
  Bottom Layer w0.254: 2.6,14.79 2.6,15.2 3.82,16.42 3.86,16.42 v1(4.4,16.97)
DVP_Y3: length 17.1
  Top Layer w0.254: v1(4.4,18.22) 4.6,18.22 4.78,18.04 5.47,18.04 U9.4 ; U1.5 v1(13.09,22.23)
  Inner1 w0.254: v1(4.4,18.22) 12.77,18.22 13.09,18.55 v1(13.09,22.23)
  Bottom Layer w0.254: v1(4.4,18.22) 4.13,18.22 2.79,19.56
DVP_Y4: length 20.4
  Top Layer w0.254: U1.4 v1(12.46,23.5) ; v1(6.69,18.85) 6.31,18.47 U9.3
  Inner1 w0.254: v1(12.46,23.5) 12.46,19.19 12.12,18.85 v1(6.69,18.85)
  Bottom Layer w0.254: v1(6.69,18.85) 6.69,21.38 6.08,21.99 TP1.1
DVP_Y5: length 16.5
  Top Layer w0.254: U9.5 5.62,17.39 6.31,17.39 6.55,17.64 v1(6.73,17.64) ; U1.6 14.11,21.09 v1(13.98,21.09)
  Inner1 w0.254: v1(6.73,17.64) 13.44,17.64 13.98,18.17 v1(13.98,21.09)
  Bottom Layer w0.254: v1(6.73,17.64) 6.64,17.55 3.2,17.55 2.84,17.19 2.47,17.19
DVP_Y6: length 16.2
  Top Layer w0.254: U9.7 6.65,16.47 v1(6.73,16.38) ; v1(15.32,18.36) 15.25,18.42 U1.8
  Inner1 w0.254: v1(15.32,18.36) 15.32,16.84 14.86,16.38 v1(6.73,16.38)
  Bottom Layer w0.254: v1(15.32,18.36) 15.26,18.41 13.21,18.41 12.65,17.86 TP6.1
DVP_Y7: length 16.7
  Top Layer w0.254: v1(6.73,15.21) 6.48,15.47 U9.9 ; U1.10 14.36,16.01 v1(16.65,16.01)
  Inner1 w0.254: v1(16.65,16.01) 16.65,15.64 16.22,15.21 v1(6.73,15.21)
  Bottom Layer w0.254: TP8.1 18.24,16.01 v1(16.65,16.01)
DVP_Y8: length 21.1
  Top Layer w0.254: v1(4.4,14.34) 4.72,14.34 4.85,14.47 U9.11 ; U1.11 16.44,14.61 v1(17.14,15.31)
  Inner1 w0.254: v1(17.14,15.31) 17.14,14.99 16.64,14.48 4.83,14.48 4.69,14.34 v1(4.4,14.34)
  Bottom Layer w0.254: TP9.1 14.99,15.42 14.99,15.37 15.17,15.19 17.02,15.19 v1(17.14,15.31)
DVP_Y9: length 26.4
  Top Layer w0.254: v1(4.01,13.6) 4.15,13.47 U9.13 ; v1(17.27,6.6) U1.16
  Inner1 w0.254: v1(17.27,6.6) 5.08,6.6 3.76,7.92 3.76,9.78 3.76,9.79 3.76,13.1 4.01,13.35
  Bottom Layer w0.254: 2.22,12.47 2.88,12.47 v1(4.01,13.6)
EN: length 34.2
  Top Layer w0.254: U1.3 15.49,24.77 v1(15.49,24.77) ; v1(23.5,6.98) 23.5,5.83 R5.1 C6.2 20.64,2.54 SW3.2
  Inner1 w0.254: v1(23.5,6.98) 23.5,24.26 22.99,24.77 v1(15.49,24.77)
I2C_SCL: length 25.6
  Top Layer w0.254: v1(4.34,10.29) 4.53,10.29 4.85,9.97 U9.20 ; v1(21.08,8.13) U1.19
  Inner1 w0.254: v1(21.08,8.13) 21.06,8.11 4.85,8.11 4.34,8.61 v1(4.34,10.29)
  Bottom Layer w0.254: TP17.1 3.77,7.71 4.34,8.28 v1(4.34,10.29)
I2C_SDA: length 24
  Top Layer w0.254: U1.20 22.35,7.49 v1(22.28,7.42) ; v1(6.72,7.52) 6.72,8.77 6.53,8.97 U9.22
  Inner1 w0.254: v1(6.72,7.52) 6.83,7.42 v1(22.28,7.42)
  Bottom Layer w0.254: v1(6.72,7.52) 6.72,6.72 6.07,6.07 TP19.1
IO2: length 34.8
  Top Layer w0.254: U1.38 30.61,24.77 30.35,24.51 v1(30.35,19.18) ; v1(46.86,8.89) 46.86,8.51 R11.1
  Inner1 w0.254: v1(30.35,19.18) 46.52,19.18 46.86,18.84 v1(46.86,13.33)
  Bottom Layer w0.254: v1(46.86,8.89) v1(46.86,13.33)
IO8: length 11.1
  Top Layer w0.254: v1(12.97,13.09) 13.22,13.34 U1.12 ; U9.12 5.62,13.89 6.31,13.89 6.6,13.6 v1(6.73,13.6)
  Inner1 w0.254: v1(12.97,13.09) 7.25,13.09 v1(6.73,13.6)
  Bottom Layer w0.254: TP10.1 11.83,11.95 v1(12.97,13.09)
IO19: length 57.5
  Top Layer w0.254: U1.13 15.11,12.07 15.79,11.38 v1(28.33,11.38) ; R4.2 v1(65.41,5.72)
  Inner1 w0.254: v1(65.41,5.72) 64.76,6.36 29.26,6.36 28.77,6.86 28.77,10.95 v1(28.33,11.38)
IO20: length 57.4
  Top Layer w0.254: R6.2 v1(65.41,7.41) ; U1.14 v1(29.6,10.8)
  Inner1 w0.254: v1(29.6,10.8) 29.67,10.74 29.24,10.3 29.24,6.96 29.43,6.77 65.02,6.77 65.47,7.22 65.47,7.35 v1(65.41,7.41)
IO21: length 8.2
  Top Layer w0.254: U1.23 26.16,9.14 26.67,8.64 v1(26.67,8.28) 26.67,5.21 27.25,4.63 U2.1
  Bottom Layer w0.254: v1(26.67,8.28) 26.08,7.69 TP14.1
IO38: length 11.3
  Top Layer w0.254: U1.31 32.51,15.88 33.02,15.37 33.02,8.76 33.85,7.93 R12.2
IO39: length 10.4
  Top Layer w0.254: U1.32 32.76,17.15 34.16,15.75 34.16,10.29 34.65,9.8 R13.2
IO40: length 20.4
  Top Layer w0.254: U1.33 35.43,18.42 36.12,17.73 SW1.2 36.12,12.91 36.89,12.13 C1.2 44.74,12.17 R1.1
IO41: length 20
  Top Layer w0.254: 44.92,14.65 44.64,14.92 Q1.1 v1(44.64,17.88) 44.64,19.06 44.02,19.69 31.74,19.69 U1.34
  Bottom Layer w0.254: TP4.1 44.64,19.24 v1(44.64,17.88)
IO45: length 10.7
  Top Layer w0.254: U2.12 30.01,9.52 U1.26 30.45,9.55 v1(31.37,8.64)
  Bottom Layer w0.254: v1(31.37,8.64) 31.37,5.42 TP12.1
IO47: length 9.9
  Top Layer w0.254: U2.14 v1(28.22,5.58) 27.45,6.35 R8.1 27.45,9.5 U1.24
  Bottom Layer w0.254: v1(28.22,5.58) 26.66,5.58 26.33,5.25 TP16.1
IO48: length 7.5
  Top Layer w0.254: 28.7,8.95 v1(28.18,8.43) ; 28.7,8.95 28.7,7.25 R9.1 29.51,6.44 U2.13 ; 28.7,8.95 U1.25
  Bottom Layer w0.254: TP18.1 29.44,8.43 v1(28.18,8.43)
MOTOR_2V8: length 10.4
  Top Layer w0.254: M1.1 46.8,24.52 C2.2 47.4,25.65 D1.1 52.3,20.75 R2.2
RGB_B_OUT: length 8.5
  Top Layer w0.254: R13.1 39.1,9.8 LED1.4 41.06,9.36 41.79,8.62 FPC1.3
RGB_G_OUT: length 5.9
  Top Layer w0.254: FPC1.2 40.54,7.59 40.27,7.86 LED1.3 37.47,7.86 R12.1
RGB_R_OUT: length 5.1
  Top Layer w0.254: R11.2 44.59,7.86 LED1.2 43.05,7.45 43.05,4.99 FPC1.4
RXD: length 10.1
  Top Layer w0.254: H1.3 36.19,22.23 U1.36
TXD: length 7
  Top Layer w0.254: U1.37 34.91,23.5 H1.2
VUSB: length 40
  Top Layer w0.305: U8.4 68.39,14.92 v1(68.83,15.37)
  Top Layer w0.355: R15.2 72.97,11.93 v1(68.99,11.93) Q2.2 63.81,9.74 D2.1 57.76,9.17 56.97,9.95 56.97,17.57 56.6,17.94 U7.4 56.18,18.62 R14.1 ; C22.2 67.75,14.98 U8.4
  Bottom Layer w0.355: v1(68.99,11.93) 68.99,15.21 v1(68.83,15.37)

## Copper pours and planes (outline as drawn; the poured copper is in the pictures)
GND on Top Layer: -4.19,32.39 82.68,32.39 82.68,-3.43 -4.19,-3.43
GND on Bottom Layer: -6.73,31.62 82.8,31.62 82.8,-3.94 -6.73,-3.94
GND on Inner1: -3.17,30.48 80.9,30.48 80.9,-2.29 -3.17,-2.29
GND on Inner2: 0.26,27.81 78.36,27.81 78.36,0.26 0.26,0.26

Small or netless copper shapes (teardrops, artwork), in the pictures only: 20 on Inner2
